# Altium schematic sheet IMU.SchDoc
size A; SheetNumber: 5; SheetTotal: 5
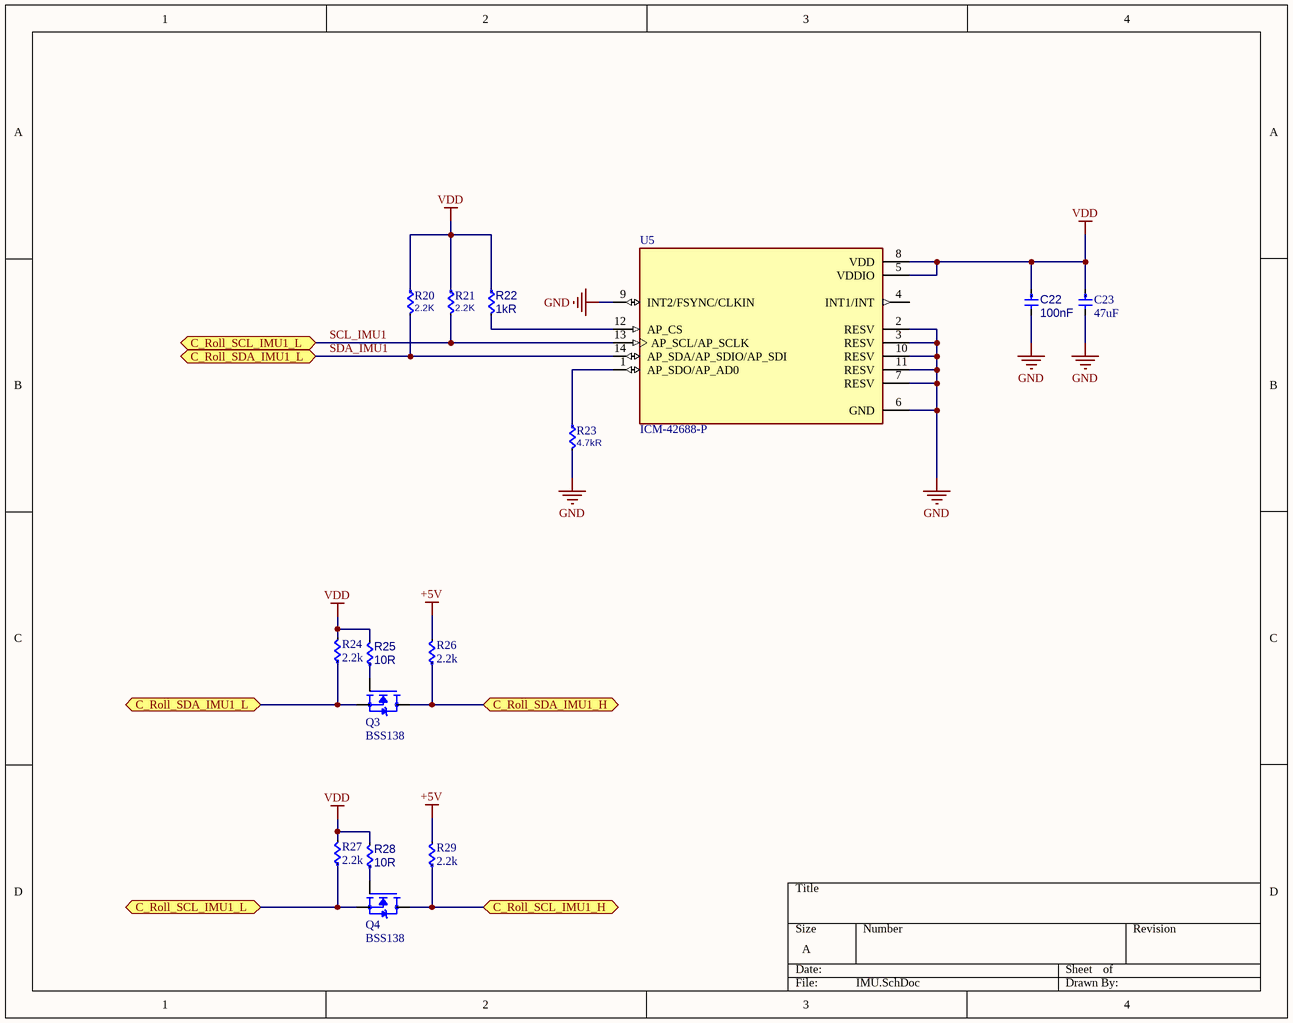
[diagram p0: IMU.SchDoc]

## Parts
C22  Capacitance: 100nF  [CAP0603]  (hidden comment: C0603C104M5RACTU)
C23  Capacitance: 47uF  [CAP0805]  (hidden comment: CL21A476MQYNNNE)
Q3  BSS138  [BSS138]
Q4  BSS138  [BSS138]
R20  Resistance: 2.2K  [RES0603]  (hidden comment: RC0603FR-072K2L)
R21  Resistance: 2.2K  [RES0603]  (hidden comment: RC0603FR-072K2L)
R22  Resistance: 1kR  [RES0603]  (hidden comment: RC0603FR-071KL)
R23  Resistance: 4.7kR  [RES0603]  (hidden comment: RC0603JR-074K7L)
R24  2.2k  [RES0603]
R25  Resistance: 10R  [RES0603]  (hidden comment: MCR03EZPJ100)
R26  2.2k  [RES0603]
R27  2.2k  [RES0603]
R28  Resistance: 10R  [RES0603]  (hidden comment: MCR03EZPJ100)
R29  2.2k  [RES0603]
U5  ICM-42688-P  [ICM-42688-P]

## Ports
C_Roll_SCL_IMU1_H (bidir), C_Roll_SCL_IMU1_L (bidir), C_Roll_SDA_IMU1_H (bidir), C_Roll_SDA_IMU1_L (bidir)

## Nets
+5V: R26.2 R29.2
GND: C22.2 C23.2 R23.2 U5.2(RESV) U5.3(RESV) U5.6(GND) U5.7(RESV) U5.9(INT2/FSYNC/CLKIN) U5.10(RESV) U5.11(RESV)
VDD: C22.1 C23.1 R20.1 R21.1 R22.1 R24.2 R25.2 R27.2 R28.2 U5.5(VDDIO) U5.8(VDD)
C_Roll_SCL_IMU1_H: Q4.3(D) R29.1 ; port C_Roll_SCL_IMU1_H
C_Roll_SDA_IMU1_H: Q3.3(D) R26.1 ; port C_Roll_SDA_IMU1_H
SCL_IMU1: Q4.2(S) R21.2 R27.1 U5.13(AP_SCL/AP_SCLK) ; port C_Roll_SCL_IMU1_L
SDA_IMU1: Q3.2(S) R20.2 R24.1 U5.14(AP_SDA/AP_SDIO/AP_SDI) ; port C_Roll_SDA_IMU1_L
NetQ3_1: Q3.1(G) R25.1
NetQ4_1: Q4.1(G) R28.1
NetR22_2: R22.2 U5.12(AP_CS)
NetR23_1: R23.1 U5.1(AP_SDO/AP_AD0)

Not connected (* = marked no-connect by the designer): U5 4(INT1/INT)

## Library data of the parts
C22 = CMP-00691-1: CAP CER 0.1UF 50V X7R 0603; Manufacturer 1: KEMET; Tolerance: 20%; Dielectric Material: Ceramic; Dissipation Factor: 2.5%; Packaging: Tape and Reel; Mount: Surface Mount,PCB; Min Operating Temperature: -55°C; Case/Package: 0603; Max Operating Temperature: 125°C; Length: 1.6mm; Voltage Rating: 50V; Width: 0.031inch; Voltage Rating (DC): 50V; Dielectric: X7R; Thickness: 0.034inch; Case Code (Imperial): 0603; Case Code (Metric): 1608; Contact Plating: Tin,Matte; Depth: 0.8mm; Height: 0.8mm; Lead Pitch: 0.7mm; Manufacturer Part Number 1: C0603C104M5RACTU; Package Quantity: 1; Radiation Hardening: No; REACH SVHC: No SVHC; Termination: SMD/SMT
C23 = 885012107014: CAP CER 47UF 6.3V X5R 0805; Tolerance: 20%; Manufacturer Part Number: CL21A476MQYNNNE; RoHS: Yes; Category: Ceramic Capacitors; Stock 1: 3580; Pricing 1: 1=0.37000, 5=0.35200, 10=0.33000, 25=0.31900, 50=0.30900, 100=0.29800 (USD); Mount: Surface Mount; Case/Package: 0805; Case Code (Metric): 2012; Case Code (Imperial): 0805; Min Operating Temperature: -55°C; Max Operating Temperature: 85°C; Packaging: Cut Tape; Voltage Rating: 6.3V; Dielectric: X5R; Voltage Rating (DC): 6.3V; Series: WCAP-CSGP; Length: 0.079inch; Width: 0.049inch; Thickness: 0.057inch; RoHS Compliant: Yes; ComponentLink1URL: http://www.farnell.com/datasheets/1958454.pdf?src-supplier=Farnell; ComponentLink1Description: http://www.farnell.com/datasheets/1958454.pdf?src-supplier=Farnell; ComponentLink2URL: http://www.farnell.com/datasheets/1958454.pdf?src-supplier=Element14; ComponentLink2Description: http://www.farnell.com/datasheets/1958454.pdf?src-supplier=Element14; ComponentLink3URL: https://katalog.we-online.de/pbs/datasheet/885012107014.pdf?src-supplier=Digi-Key; ComponentLink3Description: https://katalog.we-online.de/pbs/datasheet/885012107014.pdf?src-supplier=Digi-Key; ComponentLink4URL: http://www.farnell.com/datasheets/1958454.pdf?src-supplier=Newark; ComponentLink4Description: http://www.farnell.com/datasheets/1958454.pdf?src-supplier=Newark; Supplier 1: Newark
Q3 Q4 = BSS138: N-Channel 50 V 220mA (Ta) 350mW (Ta) Surface Mount SOT-23-3; MF: onsemi; SnapEDA_Link: https://www.snapeda.com/parts/BSS138/Onsemi/view-part/?ref=snap; Package: SOT-23-3 Motorola; Value: *; MP: BSS138; Check_prices: https://www.snapeda.com/parts/BSS138/Onsemi/view-part/?ref=eda
R20 R21 = CMP-01404-1: RES SMD 2.2K OHM 1% 1/10W 0603; Manufacturer 1: Yageo; Voltage Rating (DC): 50V; Resistance Tolerance: 5%; Temperature Coefficient: 100ppm/°C; Max Power Dissipation: 100mW; Number of Terminations: 2; Width: 0.8mm; Min Operating Temperature: -55°C; Case/Package: 0603; Military Standard: Not; Termination: SMD/SMT; Manufacturer Part Number 1: RC0603FR-072K2L; Construction: Rectangular; Features: Moisture Resistant; Length: 1.6mm; Lead Free: Lead Free; REACH SVHC: No SVHC; Voltage Rating: 50V; Case Code (Metric): 1608; Case Code (Imperial): 0603; Packaging: Tape and Reel; Max Operating Temperature: 155°C; Size Code: 0603; Resistor Type: Thick Film; Tolerance: 5%; Number of Pins: 2; Depth: 0.8mm; Power Rating: 100mW; Series: RC
R22 = CMP-00067-1: RES SMD 1K OHM 1% 1/10W 0603; Manufacturer: Yageo; Voltage Rating: 50V; Power Rating: 100mW; Temperature Coefficient: 100ppm/°C; Packaging: Tape and Reel; Min Operating Temperature: -55°C; Radiation Hardening: No; Case Code (Metric): 1608; Height: 0.45mm; Max Operating Temperature: 155°C; Composition: Thick Film; Depth: 0.8mm; Military Standard: Not; Termination: SMD/SMT; Tolerance: 1%; Lead Free: Lead Free; Length: 1.6mm; Contact Plating: Tin,Matte; Case Code (Imperial): 0603; REACH SVHC: No SVHC; Manufacturer Part Number: RC0603FR-071KL; Case/Package: 0603; Manufacturer 1: Yageo; Manufacturer Part Number 1: RC0603FR-071KL
R23 = CMP-01404-1: RES SMD 4.7K OHM 5% 1/10W 0603; Manufacturer 1: Yageo; Voltage Rating (DC): 50V; Temperature Coefficient: 100ppm/°C; Max Power Dissipation: 100mW; Number of Terminations: 2; Width: 0.8mm; Min Operating Temperature: -55°C; Case/Package: 0603; Military Standard: Not; Termination: SMD/SMT; Manufacturer Part Number 1: RC0603JR-074K7L; Construction: Rectangular; Features: Moisture Resistant; Length: 1.6mm; Resistance Tolerance: 5%; Lead Free: Lead Free; REACH SVHC: No SVHC; Voltage Rating: 50V; Case Code (Metric): 1608; Case Code (Imperial): 0603; Packaging: Tape and Reel; Max Operating Temperature: 155°C; Size Code: 0603; Resistor Type: Thick Film; Tolerance: 5%; Number of Pins: 2; Depth: 0.8mm; Power Rating: 100mW; Series: RC
R24 R26 R27 R29 = RC0603FR-072K2L: Res Thick Film 0603 2.2K Ohm 1% 0.1W(1/10W) +/-100ppm/C Epoxy Pad SMD T/R; Manufacturer: Yageo Group; Max Power Dissipation: 100mW; Resistance: 2.2kΩ; Temperature Coefficient: 100ppm/°C; Voltage Rating: 75V; Voltage Rating (DC): 50V; Supplier 1: Avnet; Manufacturer Part Number: RC0603FR-072K2L; RoHS: Compliant; Category: Chip SMD Resistors; Stock 1: 415000; Pricing 1: 5000=0.00146, 10000=0.00141, 20000=0.00136, 30000=0.00131, 40000=0.00127 (USD); Case/Package: 0603; Case Code (Imperial): 0603; Case Code (Metric): 0603; China RoHS: Non-Compliant; Composition: Thick Film; Depth: 800µm; Features: Moisture Resistant; Height: 450µm; Lead Free: Lead Free; Length: 1.6mm; Lifecycle Status: Production; Max Operating Temperature: 155°C; Military Standard: Not; Min Operating Temperature: -55°C; Mount: Surface Mount; Number of Pins: 2; Number of Terminals: 2; Number of Terminations: 2; Packaging: Tape & Reel; Power Dissipation: 100mW; Power Rating: 100mW; REACH SVHC: Yes; Schedule B: 8533210045, 8533210045|8533210045|8533210045|8533210045|8533210045|8533210045|8533210045|8533210045|8533210045|8533210045|8533210045|8533210045|8533210045|8533210045|8533210045, 8533210045|8533210045|8533210045|8533210045|8533210045|8533210045|8533210045|8533210045|8533210045|8533210045|8533210045|8533210045|8533210045|8533210045|8533210045|8533210045, 8533210045|8533210045|8533210045|8533210045|8533210045|8533210045|8533210045|8533210045|8533210045|8533210045|8533210045|8533210045|8533210045|8533210045|8533210045|8533210045|8533210045; Termination: SMD/SMT; Tolerance: 1%; Width: 800µm; Working Voltage: 75V; ComponentLink1URL: https://datasheet.octopart.com:443/RC0603FR-072K2L-Yageo-datasheet-175887523.pdf?src-supplier=IHS; ComponentLink1Description: https://datasheet.octopart.com:443/RC0603FR-072K2L-Yageo-datasheet-175887523.pdf?src-supplier=IHS; ComponentLink2URL: https://datasheet.octopart.com:443/RC0603FR-072K2L-Yageo-datasheet-103092701.pdf?src-supplier=Upverter; ComponentLink2Description: https://datasheet.octopart.com:443/RC0603FR-072K2L-Yageo-datasheet-103092701.pdf?src-supplier=Upverter; ComponentLink3URL: https://datasheet.octopart.com:443/RC0603FR-072K2L-Yageo-datasheet-8328172.pdf?src-supplier=Newark; ComponentLink3Description: https://datasheet.octopart.com:443/RC0603FR-072K2L-Yageo-datasheet-8328172.pdf?src-supplier=Newark; ComponentLink4URL: https://datasheet.octopart.com:443/RC0603FR-072K2L-Yageo-datasheet-12596169.pdf?src-supplier=Newark; ComponentLink4Description: https://datasheet.octopart.com:443/RC0603FR-072K2L-Yageo-datasheet-12596169.pdf?src-supplier=Newark; ComponentLink5URL: https://datasheet.octopart.com:443/RC0603FR-072K2L-Yageo-datasheet-13691069.pdf?src-supplier=Newark; ComponentLink5Description: https://datasheet.octopart.com:443/RC0603FR-072K2L-Yageo-datasheet-13691069.pdf?src-supplier=Newark; ComponentLink6URL: https://datasheet.octopart.com:443/RC0603FR-072K2L-Yageo-datasheet-34211833.pdf?src-supplier=element14+APAC; ComponentLink6Description: https://datasheet.octopart.com:443/RC0603FR-072K2L-Yageo-datasheet-34211833.pdf?src-supplier=element14+APAC; ComponentLink7URL: https://datasheet.octopart.com:443/RC0603FR-072K2L-Yageo-datasheet-62067350.pdf?src-supplier=element14+APAC; ComponentLink7Description: https://datasheet.octopart.com:443/RC0603FR-072K2L-Yageo-datasheet-62067350.pdf?src-supplier=element14+APAC; ComponentLink8URL: https://datasheet.octopart.com:443/RC0603FR-072K2L-Yageo-datasheet-17842380.pdf?src-supplier=element14+APAC; ComponentLink8Description: https://datasheet.octopart.com:443/RC0603FR-072K2L-Yageo-datasheet-17842380.pdf?src-supplier=element14+APAC; ComponentLink9URL: https://datasheet.octopart.com:443/RC0603FR-072K2L-Yageo-datasheet-21426514.pdf?src-supplier=element14+APAC; ComponentLink9Description: https://datasheet.octopart.com:443/RC0603FR-072K2L-Yageo-datasheet-21426514.pdf?src-supplier=element14+APAC; ComponentLink10URL: https://datasheet.octopart.com:443/RC0603FR-072K2L-Yageo-datasheet-164759695.pdf?src-supplier=Future+Electronics; ComponentLink10Description: https://datasheet.octopart.com:443/RC0603FR-072K2L-Yageo-datasheet-164759695.pdf?src-supplier=Future+Electronics; ComponentLink11URL: https://datasheet.octopart.com:443/RC0603FR-072K2L-Yageo-datasheet-137700087.pdf?src-supplier=Future+Electronics; ComponentLink11Description: https://datasheet.octopart.com:443/RC0603FR-072K2L-Yageo-datasheet-137700087.pdf?src-supplier=Future+Electronics; ComponentLink12URL: https://datasheet.octopart.com:443/RC0603FR-072K2L-Yageo-datasheet-27584510.pdf?src-supplier=Future+Electronics; ComponentLink12Description: https://datasheet.octopart.com:443/RC0603FR-072K2L-Yageo-datasheet-27584510.pdf?src-supplier=Future+Electronics; ComponentLink13URL: https://datasheet.octopart.com:443/RC0603FR-072K2L-Yageo-datasheet-15599030.pdf?src-supplier=Future+Electronics; ComponentLink13Description: https://datasheet.octopart.com:443/RC0603FR-072K2L-Yageo-datasheet-15599030.pdf?src-supplier=Future+Electronics; ComponentLink14URL: https://datasheet.octopart.com:443/RC0603FR-072K2L-Yageo-datasheet-8324193.pdf?src-supplier=Future+Electronics; ComponentLink14Description: https://datasheet.octopart.com:443/RC0603FR-072K2L-Yageo-datasheet-8324193.pdf?src-supplier=Future+Electronics; ComponentLink15URL: https://datasheet.octopart.com:443/RC0603FR-072K2L-Yageo-datasheet-79472498.pdf?src-supplier=Megastar; ComponentLink15Description: https://datasheet.octopart.com:443/RC0603FR-072K2L-Yageo-datasheet-79472498.pdf?src-supplier=Megastar; ComponentLink16URL: https://datasheet.octopart.com/RC0603FR-072K2L-Yageo-datasheet-73766026.pdf; ComponentLink16Description: https://datasheet.octopart.com/RC0603FR-072K2L-Yageo-datasheet-73766026.pdf; ComponentLink17URL: https://datasheet.octopart.com:443/RC0603FR-072K2L-Yageo-datasheet-118562.pdf?src-supplier=DigiKey; ComponentLink17Description: https://datasheet.octopart.com:443/RC0603FR-072K2L-Yageo-datasheet-118562.pdf?src-supplier=DigiKey; ComponentLink18URL: https://datasheet.octopart.com:443/RC0603FR-072K2L-Yageo-datasheet-499455.pdf?src-supplier=element14; ComponentLink18Description: https://datasheet.octopart.com:443/RC0603FR-072K2L-Yageo-datasheet-499455.pdf?src-supplier=element14; ComponentLink19URL: http://sigma.octopart.com:80/rohs_statement/Yageo-company-2.pdf?src-supplier=Compliance+Statements; ComponentLink19Description: http://sigma.octopart.com:80/rohs_statement/Yageo-company-2.pdf?src-supplier=Compliance+Statements; ComponentLink20URL: http://sigma.octopart.com:80/conflict_mineral_statement/Yageo-company-3.pdf?src-supplier=Compliance+Statements; ComponentLink20Description: http://sigma.octopart.com:80/conflict_mineral_statement/Yageo-company-3.pdf?src-supplier=Compliance+Statements; Supplier Part Number 1: RC0603FR-072K2L
R25 R28 = CMP-01078-4: RES SMD 10 OHM 5% 1/10W 0603; Manufacturer 1: Rohm Semiconductor; Voltage Rating (DC): 50V; Power Rating: 100mW; Temperature Coefficient: 200ppm/°C; Manufacturer Part Number 1: MCR03EZPJ100; Tolerance: 5%; Contact Plating: Tin; Mount: Surface Mount; Max Operating Temperature: 155°C; Lead Free: Lead Free; Min Operating Temperature: -55°C; Case/Package: 0603; Composition: Thick Film
U5 = ICM-42688-P: Accelerometer, Gyroscope, 6 Axis Sensor Output; Package: None; MP: ICM-42688-P; Value: *; Availability: Unavailable; Price: None